# Altium schematic sheet LOW_CURRENT_OUTPUTS.SchDoc
size A
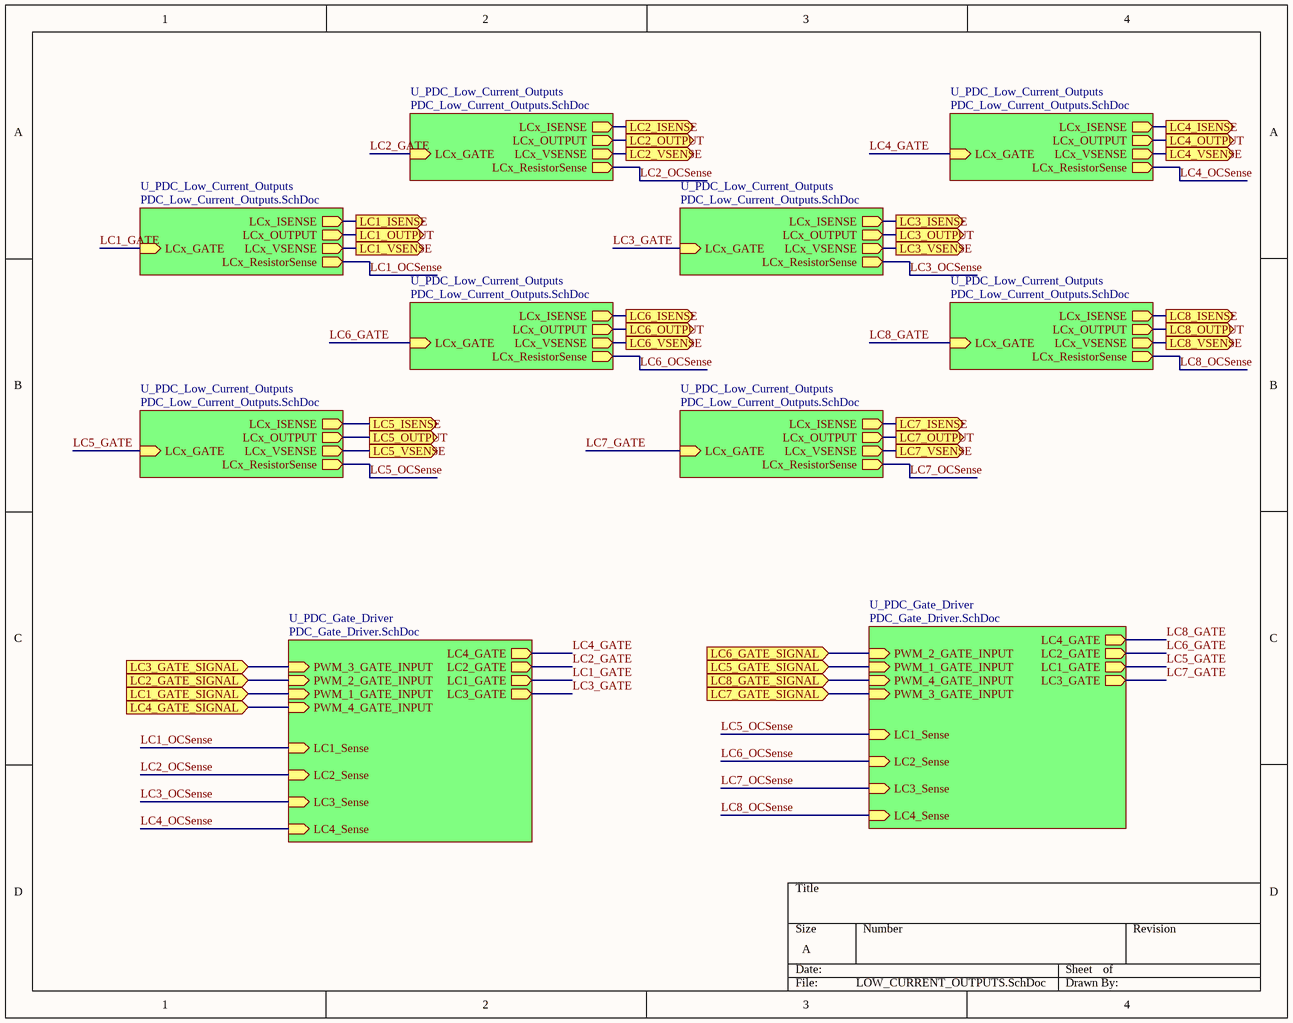
[diagram p0: LOW_CURRENT_OUTPUTS.SchDoc]

## Sub-sheets
U_PDC_Gate_Driver = PDC_Gate_Driver.SchDoc: LC4_GATE (out), LC2_GATE (out), LC1_GATE (out), LC3_GATE (out), PWM_3_GATE_INPUT (in), PWM_2_GATE_INPUT (in), PWM_1_GATE_INPUT (in), PWM_4_GATE_INPUT (in), LC4_Sense (in), LC2_Sense (in), LC1_Sense (in), LC3_Sense (in)
U_PDC_Gate_Driver = PDC_Gate_Driver.SchDoc: LC4_GATE (out), LC2_GATE (out), LC1_GATE (out), LC3_GATE (out), PWM_2_GATE_INPUT (in), PWM_1_GATE_INPUT (in), PWM_4_GATE_INPUT (in), PWM_3_GATE_INPUT (in), LC4_Sense (in), LC2_Sense (in), LC1_Sense (in), LC3_Sense (in)
U_PDC_Low_Current_Outputs = PDC_Low_Current_Outputs.SchDoc: LCx_ISENSE (out), LCx_OUTPUT (out), LCx_VSENSE (out), LCx_GATE (in), LCx_ResistorSense (out)
U_PDC_Low_Current_Outputs = PDC_Low_Current_Outputs.SchDoc: LCx_ISENSE (out), LCx_OUTPUT (out), LCx_VSENSE (out), LCx_GATE (in), LCx_ResistorSense (out)
U_PDC_Low_Current_Outputs = PDC_Low_Current_Outputs.SchDoc: LCx_ISENSE (out), LCx_OUTPUT (out), LCx_VSENSE (out), LCx_GATE (in), LCx_ResistorSense (out)
U_PDC_Low_Current_Outputs = PDC_Low_Current_Outputs.SchDoc: LCx_ISENSE (out), LCx_OUTPUT (out), LCx_VSENSE (out), LCx_GATE (in), LCx_ResistorSense (out)
U_PDC_Low_Current_Outputs = PDC_Low_Current_Outputs.SchDoc: LCx_ISENSE (out), LCx_OUTPUT (out), LCx_VSENSE (out), LCx_GATE (in), LCx_ResistorSense (out)
U_PDC_Low_Current_Outputs = PDC_Low_Current_Outputs.SchDoc: LCx_ISENSE (out), LCx_OUTPUT (out), LCx_VSENSE (out), LCx_GATE (in), LCx_ResistorSense (out)
U_PDC_Low_Current_Outputs = PDC_Low_Current_Outputs.SchDoc: LCx_ISENSE (out), LCx_OUTPUT (out), LCx_VSENSE (out), LCx_GATE (in), LCx_ResistorSense (out)
U_PDC_Low_Current_Outputs = PDC_Low_Current_Outputs.SchDoc: LCx_ISENSE (out), LCx_OUTPUT (out), LCx_VSENSE (out), LCx_GATE (in), LCx_ResistorSense (out)

## Ports
LC1_GATE_SIGNAL (in), LC1_ISENSE (out), LC1_OUTPUT (out), LC1_VSENSE (out), LC2_GATE_SIGNAL (in), LC2_ISENSE (out), LC2_OUTPUT (out), LC2_VSENSE (out), LC3_GATE_SIGNAL (in), LC3_ISENSE (out), LC3_OUTPUT (out), LC3_VSENSE (out), LC4_GATE_SIGNAL (in), LC4_ISENSE (out), LC4_OUTPUT (out), LC4_VSENSE (out), LC5_GATE_SIGNAL (in), LC5_ISENSE (out), LC5_OUTPUT (out), LC5_VSENSE (out), LC6_GATE_SIGNAL (in), LC6_ISENSE (out), LC6_OUTPUT (out), LC6_VSENSE (out), LC7_GATE_SIGNAL (in), LC7_ISENSE (out), LC7_OUTPUT (out), LC7_VSENSE (out), LC8_GATE_SIGNAL (in), LC8_ISENSE (out), LC8_OUTPUT (out), LC8_VSENSE (out)

## Nets
LC1_GATE: sheet U_PDC_Low_Current_Outputs/LCx_GATE, sheet U_PDC_Gate_Driver/LC1_GATE
LC1_GATE_SIGNAL: port LC1_GATE_SIGNAL, sheet U_PDC_Gate_Driver/PWM_1_GATE_INPUT
LC1_ISENSE: port LC1_ISENSE, sheet U_PDC_Low_Current_Outputs/LCx_ISENSE
LC1_OCSense: sheet U_PDC_Low_Current_Outputs/LCx_ResistorSense, sheet U_PDC_Gate_Driver/LC1_Sense
LC1_OUTPUT: port LC1_OUTPUT, sheet U_PDC_Low_Current_Outputs/LCx_OUTPUT
LC1_VSENSE: port LC1_VSENSE, sheet U_PDC_Low_Current_Outputs/LCx_VSENSE
LC2_GATE: sheet U_PDC_Low_Current_Outputs/LCx_GATE, sheet U_PDC_Gate_Driver/LC2_GATE
LC2_GATE_SIGNAL: port LC2_GATE_SIGNAL, sheet U_PDC_Gate_Driver/PWM_2_GATE_INPUT
LC2_ISENSE: port LC2_ISENSE, sheet U_PDC_Low_Current_Outputs/LCx_ISENSE
LC2_OCSense: sheet U_PDC_Low_Current_Outputs/LCx_ResistorSense, sheet U_PDC_Gate_Driver/LC2_Sense
LC2_OUTPUT: port LC2_OUTPUT, sheet U_PDC_Low_Current_Outputs/LCx_OUTPUT
LC2_VSENSE: port LC2_VSENSE, sheet U_PDC_Low_Current_Outputs/LCx_VSENSE
LC3_GATE: sheet U_PDC_Low_Current_Outputs/LCx_GATE, sheet U_PDC_Gate_Driver/LC3_GATE
LC3_GATE_SIGNAL: port LC3_GATE_SIGNAL, sheet U_PDC_Gate_Driver/PWM_3_GATE_INPUT
LC3_ISENSE: port LC3_ISENSE, sheet U_PDC_Low_Current_Outputs/LCx_ISENSE
LC3_OCSense: sheet U_PDC_Low_Current_Outputs/LCx_ResistorSense, sheet U_PDC_Gate_Driver/LC3_Sense
LC3_OUTPUT: port LC3_OUTPUT, sheet U_PDC_Low_Current_Outputs/LCx_OUTPUT
LC3_VSENSE: port LC3_VSENSE, sheet U_PDC_Low_Current_Outputs/LCx_VSENSE
LC4_GATE: sheet U_PDC_Low_Current_Outputs/LCx_GATE, sheet U_PDC_Gate_Driver/LC4_GATE
LC4_GATE_SIGNAL: port LC4_GATE_SIGNAL, sheet U_PDC_Gate_Driver/PWM_4_GATE_INPUT
LC4_ISENSE: port LC4_ISENSE, sheet U_PDC_Low_Current_Outputs/LCx_ISENSE
LC4_OCSense: sheet U_PDC_Low_Current_Outputs/LCx_ResistorSense, sheet U_PDC_Gate_Driver/LC4_Sense
LC4_OUTPUT: port LC4_OUTPUT, sheet U_PDC_Low_Current_Outputs/LCx_OUTPUT
LC4_VSENSE: port LC4_VSENSE, sheet U_PDC_Low_Current_Outputs/LCx_VSENSE
LC5_GATE: sheet U_PDC_Low_Current_Outputs/LCx_GATE, sheet U_PDC_Gate_Driver/LC1_GATE
LC5_GATE_SIGNAL: port LC5_GATE_SIGNAL, sheet U_PDC_Gate_Driver/PWM_1_GATE_INPUT
LC5_ISENSE: port LC5_ISENSE, sheet U_PDC_Low_Current_Outputs/LCx_ISENSE
LC5_OCSense: sheet U_PDC_Low_Current_Outputs/LCx_ResistorSense, sheet U_PDC_Gate_Driver/LC1_Sense
LC5_OUTPUT: port LC5_OUTPUT, sheet U_PDC_Low_Current_Outputs/LCx_OUTPUT
LC5_VSENSE: port LC5_VSENSE, sheet U_PDC_Low_Current_Outputs/LCx_VSENSE
LC6_GATE: sheet U_PDC_Low_Current_Outputs/LCx_GATE, sheet U_PDC_Gate_Driver/LC2_GATE
LC6_GATE_SIGNAL: port LC6_GATE_SIGNAL, sheet U_PDC_Gate_Driver/PWM_2_GATE_INPUT
LC6_ISENSE: port LC6_ISENSE, sheet U_PDC_Low_Current_Outputs/LCx_ISENSE
LC6_OCSense: sheet U_PDC_Low_Current_Outputs/LCx_ResistorSense, sheet U_PDC_Gate_Driver/LC2_Sense
LC6_OUTPUT: port LC6_OUTPUT, sheet U_PDC_Low_Current_Outputs/LCx_OUTPUT
LC6_VSENSE: port LC6_VSENSE, sheet U_PDC_Low_Current_Outputs/LCx_VSENSE
LC7_GATE: sheet U_PDC_Low_Current_Outputs/LCx_GATE, sheet U_PDC_Gate_Driver/LC3_GATE
LC7_GATE_SIGNAL: port LC7_GATE_SIGNAL, sheet U_PDC_Gate_Driver/PWM_3_GATE_INPUT
LC7_ISENSE: port LC7_ISENSE, sheet U_PDC_Low_Current_Outputs/LCx_ISENSE
LC7_OCSense: sheet U_PDC_Low_Current_Outputs/LCx_ResistorSense, sheet U_PDC_Gate_Driver/LC3_Sense
LC7_OUTPUT: port LC7_OUTPUT, sheet U_PDC_Low_Current_Outputs/LCx_OUTPUT
LC7_VSENSE: port LC7_VSENSE, sheet U_PDC_Low_Current_Outputs/LCx_VSENSE
LC8_GATE: sheet U_PDC_Low_Current_Outputs/LCx_GATE, sheet U_PDC_Gate_Driver/LC4_GATE
LC8_GATE_SIGNAL: port LC8_GATE_SIGNAL, sheet U_PDC_Gate_Driver/PWM_4_GATE_INPUT
LC8_ISENSE: port LC8_ISENSE, sheet U_PDC_Low_Current_Outputs/LCx_ISENSE
LC8_OCSense: sheet U_PDC_Low_Current_Outputs/LCx_ResistorSense, sheet U_PDC_Gate_Driver/LC4_Sense
LC8_OUTPUT: port LC8_OUTPUT, sheet U_PDC_Low_Current_Outputs/LCx_OUTPUT
LC8_VSENSE: port LC8_VSENSE, sheet U_PDC_Low_Current_Outputs/LCx_VSENSE